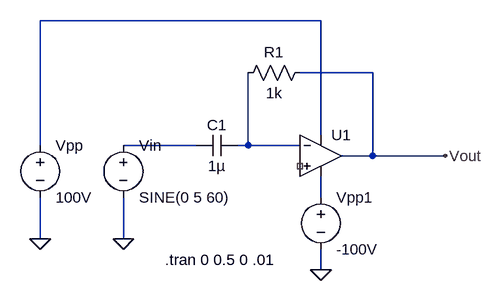
[diagram p0: schematic Differentiator_op_amp.asc]
Differentiator_op_amp.asc, the LTspice schematic file:
Version 4
SHEET 1 880 680
WIRE 256 -32 -176 -32
WIRE 336 48 224 48
WIRE 256 144 256 -32
WIRE -176 160 -176 -32
WIRE 64 160 -48 160
WIRE 144 160 144 48
WIRE 144 160 128 160
WIRE 224 160 144 160
WIRE 336 176 336 48
WIRE 336 176 288 176
WIRE 448 176 336 176
WIRE 256 240 256 208
WIRE -176 304 -176 240
WIRE -48 304 -48 240
WIRE 256 352 256 320
FLAG -176 304 0
FLAG -48 304 0
FLAG 256 352 0
FLAG 448 176 Vout
SYMBOL Opamps\\UniversalOpamp2 256 176 R0
SYMATTR InstName U1
SYMBOL voltage -48 144 R0
WINDOW 123 0 0 Left 0
WINDOW 39 0 0 Left 0
SYMATTR InstName Vin
SYMATTR Value SINE(0 5 60)
SYMBOL cap 128 144 R90
WINDOW 0 0 32 VBottom 2
WINDOW 3 32 32 VTop 2
SYMATTR InstName C1
SYMATTR Value 1µ
SYMBOL res 240 32 R90
WINDOW 0 0 56 VBottom 2
WINDOW 3 32 56 VTop 2
SYMATTR InstName R1
SYMATTR Value 1k
SYMBOL voltage -176 144 R0
WINDOW 123 0 0 Left 0
WINDOW 39 0 0 Left 0
SYMATTR InstName Vpp
SYMATTR Value 100V
SYMBOL voltage 256 224 R0
WINDOW 123 0 0 Left 0
WINDOW 39 0 0 Left 0
SYMATTR InstName Vpp1
SYMATTR Value -100V
TEXT 16 336 Left 2 !.tran 0 0.5 0 .01

The netlist it stands for:
* Differentiator_op_amp.asc
XU1 NC_01 N003 N001 N004 Vout level.2 Avol=1Meg GBW=10Meg Slew=10Meg ilimit=25m rail=0 Vos=0 phimargin=45 en=0 enk=0 in=0 ink=0 Rin=500Meg  ; pins IN+ IN- V+ V- OUT
Vin N002 0 SINE(0 5 60)
C1 N003 N002 1µ
R1 Vout N003 1k
Vpp N001 0 100V
Vpp1 N004 0 -100V
.tran 0 0.5 0 .01
.lib UniversalOpamps2.sub
.backanno
.end